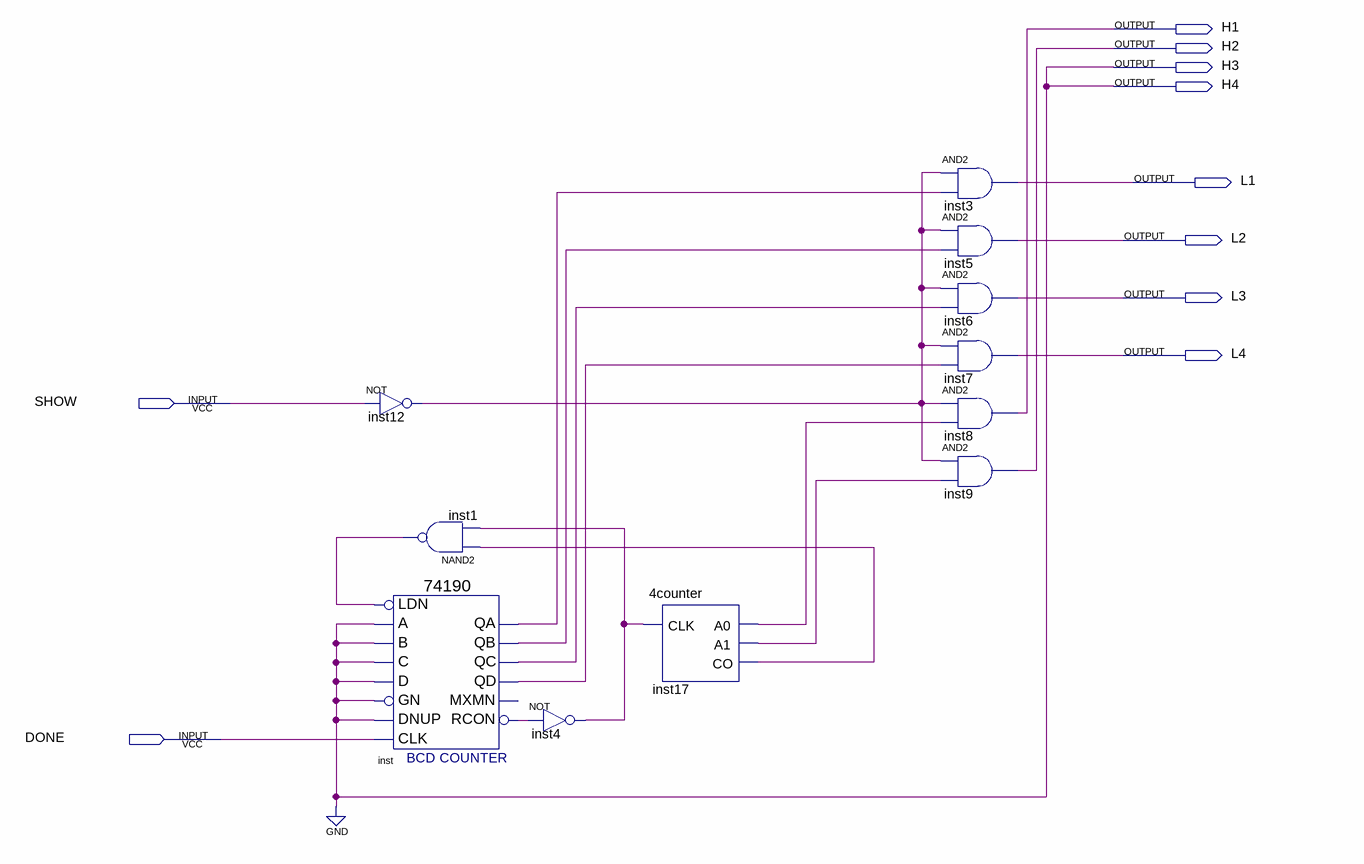
[diagram p0: schematic sheet]
// Quartus schematic 50counter.bdf as structural Verilog: 11 symbols, 10 pins
module \50counter  (
  input  SHOW,
  input  DONE,
  output H1,
  output H2,
  output H3,
  output H4,
  output L1,
  output L2,
  output L3,
  output L4
);

  wire inst1_out, inst4_out, inst12_out, inst17_a0, inst17_a1, inst17_co, inst_qa, inst_qb, inst_qc, inst_qd,
       inst_rcon;

  not inst12 (inst12_out, SHOW);
  \74190  inst (
    .LDN(inst1_out), .A(1'b0), .C(1'b0), .B(1'b0), .D(1'b0), .GN(1'b0), .CLK(DONE), .DNUP(1'b0),
    .QA(inst_qa), .QB(inst_qb), .QD(inst_qd), .QC(inst_qc), .RCON(inst_rcon));  // open: MXMN
  nand inst1 (inst1_out, inst17_co, inst4_out);
  not inst4 (inst4_out, inst_rcon);
  \4counter  inst17 (.CLK(inst4_out), .A0(inst17_a0), .A1(inst17_a1), .CO(inst17_co));
  and inst3 (L1, inst12_out, inst_qa);
  and inst5 (L2, inst12_out, inst_qb);
  and inst6 (L3, inst12_out, inst_qc);
  and inst7 (L4, inst12_out, inst_qd);
  and inst8 (H1, inst12_out, inst17_a0);
  and inst9 (H2, inst12_out, inst17_a1);

  assign H3 = 1'b0;
  assign H4 = 1'b0;
endmodule
